# EAGLE design LightPlay1 (EAGLE 7.2.0)
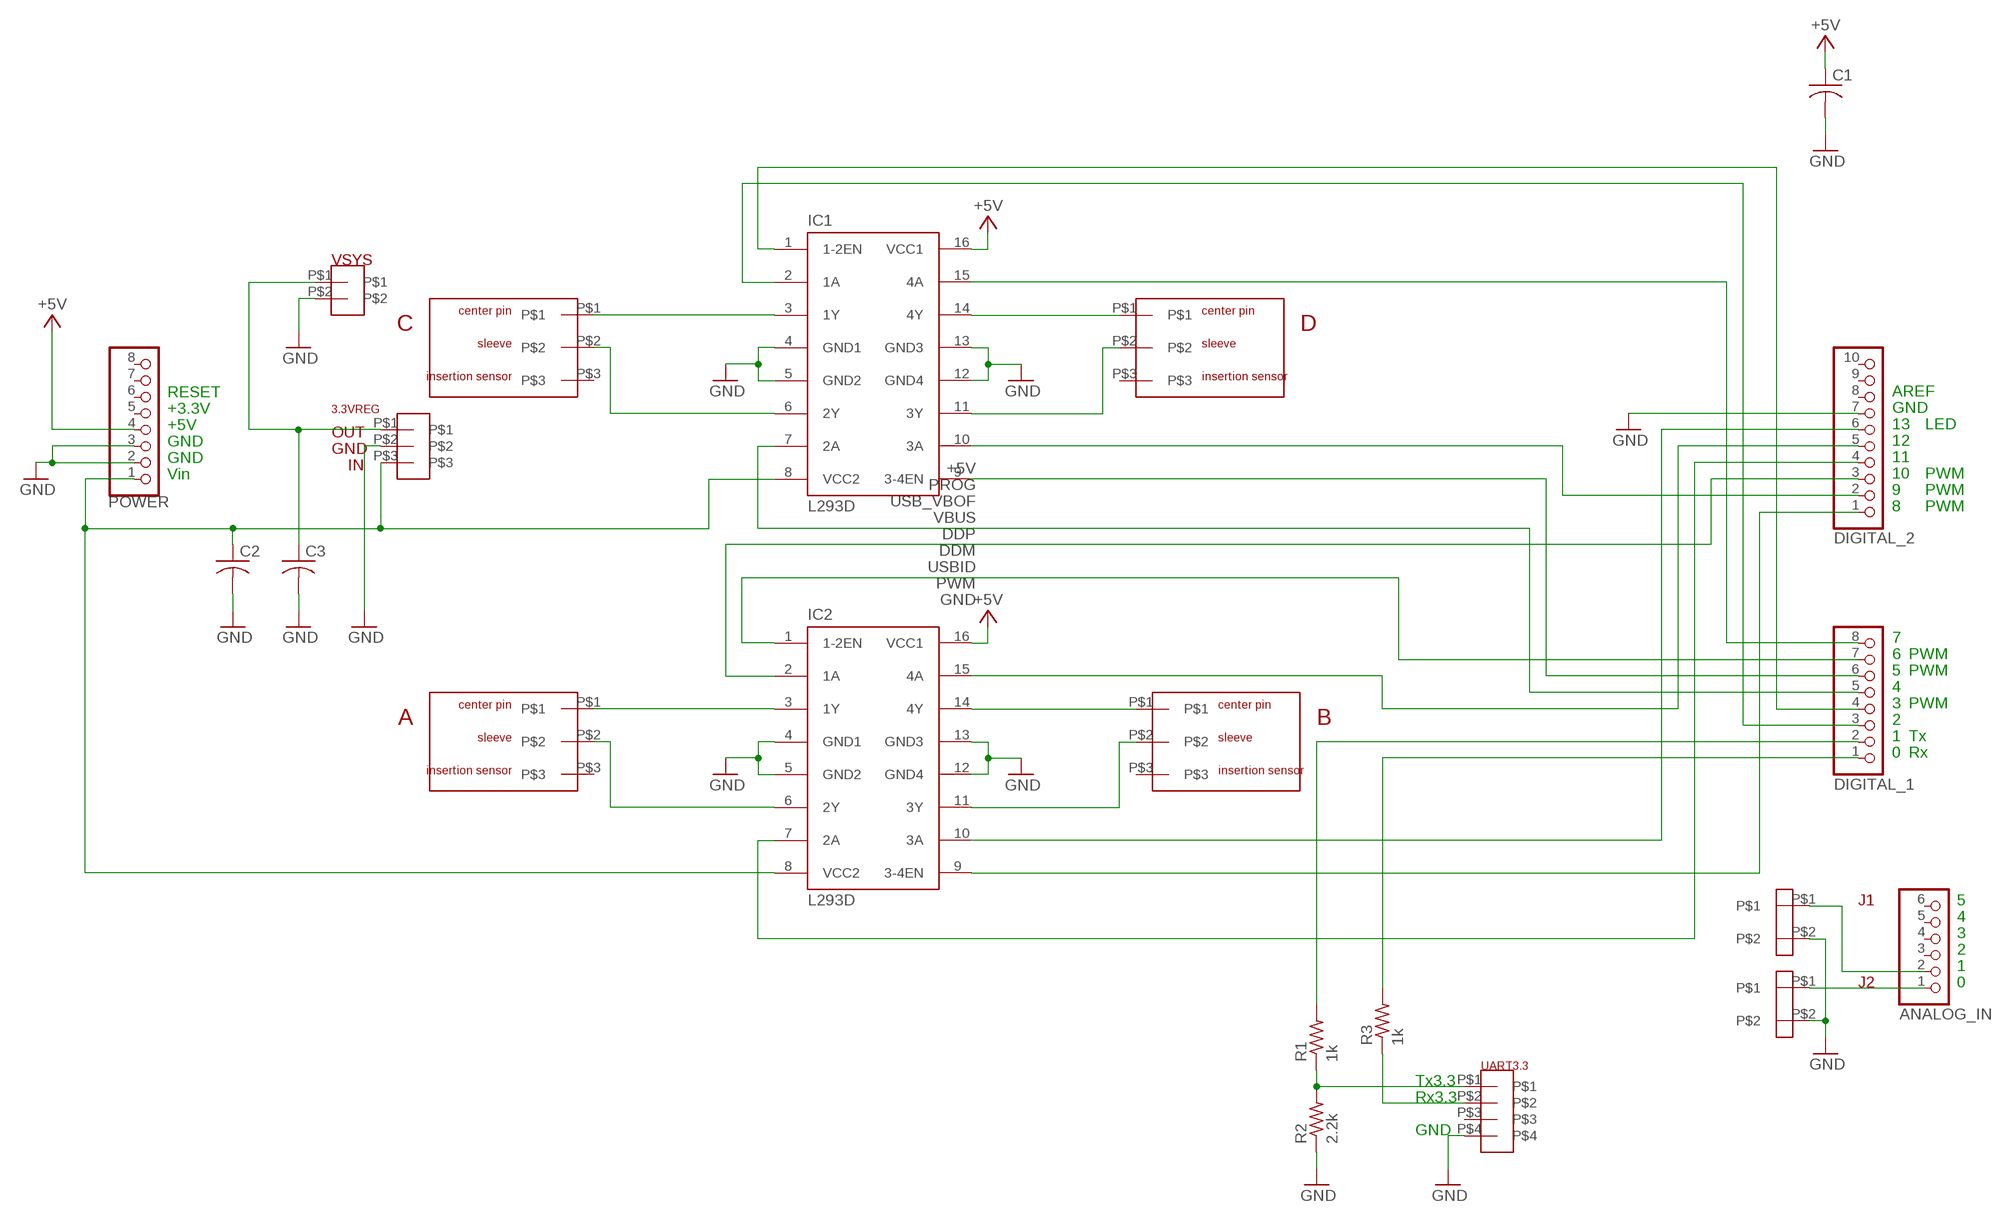
[diagram p0: schematic, sheet 1]

## Parts
3.3VREG  LP38691_33REG  [TO-252]
A  PJ-075DH-SMT-TR  [PJ-075DH-SMT-TR]
ANALOG_IN  PINHD-1X6TH  [1X06-TH]
B  PJ-075DH-SMT-TR  [PJ-075DH-SMT-TR]
C  PJ-075DH-SMT-TR  [PJ-075DH-SMT-TR]
C1  C-USC1206  [C1206]
C2  C-USC1206  [C1206]
C3  C-USC1206  [C1206]
D  PJ-075DH-SMT-TR  [PJ-075DH-SMT-TR]
DIGITAL_1  PINHD-1X8TH  [1X08-TH]
DIGITAL_2  PINHD-1X10TH  [1X10-TH]
IC1  L293D  [DIL16]
IC2  L293D  [DIL16]
J1  3.5MM_2PIN_SCREWTERMINAL_SPARKFUN  [1X02_3.5_SCREWTERM]
J2  3.5MM_2PIN_SCREWTERMINAL_SPARKFUN  [1X02_3.5_SCREWTERM]
POWER  PINHD-1X8TH  [1X08-TH]
R1  1k  R-US_M1206  [M1206]
R2  2.2k  R-US_M1206  [M1206]
R3  1k  R-US_M1206  [M1206]
UART3.3  4PADS_ROBBIE  [1X04_ROBBIE]
VSYS  1X2HEADER_ROBBIE  [1X2HEADER_ROBBIE]

## Nets
+5V: C1.1 IC1.16(VCC1) IC2.16(VCC1) POWER.4
GND: 3.3VREG.P$2 C1.2 C2.2 C3.2 DIGITAL_2.7 IC1.4(GND1) IC1.5(GND2) IC1.12(GND4) IC1.13(GND3) IC2.4(GND1) IC2.5(GND2) IC2.12(GND4) IC2.13(GND3) J1.P$2 J2.P$2 POWER.2 POWER.3 R2.1 UART3.3.P$4 VSYS.P$2
N$1: D.P$2 IC1.11(3Y)
N$2: ANALOG_IN.1 J2.P$1
N$3: D.P$1 IC1.14(4Y)
N$4: B.P$1 IC2.14(4Y)
N$5: ANALOG_IN.2 J1.P$1
N$6: 3.3VREG.P$3 C2.1 IC1.8(VCC2) IC2.8(VCC2) POWER.1
N$7: B.P$2 IC2.11(3Y)
N$8: C.P$1 IC1.3(1Y)
N$9: C.P$2 IC1.6(2Y)
N$10: A.P$1 IC2.3(1Y)
N$11: A.P$2 IC2.6(2Y)
N$12: DIGITAL_1.4 IC1.1(1-2EN)
N$13: DIGITAL_1.6 IC1.9(3-4EN)
N$14: DIGITAL_1.7 IC2.1(1-2EN)
N$15: DIGITAL_2.1 IC2.9(3-4EN)
N$16: DIGITAL_1.3 IC1.2(1A)
N$17: DIGITAL_1.5 IC1.7(2A)
N$18: DIGITAL_1.8 IC1.15(4A)
N$19: DIGITAL_2.2 IC1.10(3A)
N$20: DIGITAL_2.3 IC2.2(1A)
N$21: DIGITAL_2.4 IC2.7(2A)
N$22: DIGITAL_2.5 IC2.15(4A)
N$23: DIGITAL_2.6 IC2.10(3A)
N$25: 3.3VREG.P$1 C3.1 VSYS.P$1
N$26: R1.1 R2.2 UART3.3.P$1
N$27: DIGITAL_1.2 R1.2
N$28: DIGITAL_1.1 R3.2
N$29: R3.1 UART3.3.P$2
Unconnected: A.P$3 ANALOG_IN.3 ANALOG_IN.4 ANALOG_IN.5 ANALOG_IN.6 B.P$3 C.P$3 D.P$3 DIGITAL_2.8 DIGITAL_2.9 DIGITAL_2.10 POWER.5 POWER.6 POWER.7 POWER.8 UART3.3.P$3

## Notes on the sheet
- RESET | AREF
- +3.3V | GND
- +5V | 13 | LED
- GND | 12
- GND | +5V | 11
- Vin | PROG | 10 | PWM
- USB_VBOF | 9 | PWM
- VBUS | 8 | PWM
- DDP
- DDM
- USBID
- PWM
- GND
- 7
- 6 | PWM
- 5 | PWM
- 4
- 3 | PWM
- 2
- 1 | Tx
- 0 | Rx
- 5
- 4
- 3
- 2
- 1
- 0
- Tx3.3
- Rx3.3
- GND

## Library data of the parts
3.3VREG = robbie:LP38691_33REG
A B C D = robbie:PJ-075DH-SMT-TR
ANALOG_IN = SmartPrj:PINHD-1X6: PIN HEADER
C1-C3 = resistor:C-US: CAPACITOR, American symbol
DIGITAL_1 POWER = SmartPrj:PINHD-1X8: PIN HEADER
DIGITAL_2 = SmartPrj:PINHD-1X10: PIN HEADER
IC1 IC2 = st-microelectronics:L293D: PUSH-PULL 4 CHANNEL DRIVER; MPN: L293D; OC_FARNELL: 9589619; OC_NEWARK: 56P8249
J1 J2 = robbie:3.5MM_2PIN_SCREWTERMINAL_SPARKFUN
R1-R3 = robbie:R-US_: RESISTOR, American symbol
UART3.3 = robbie:4PADS_ROBBIE
VSYS = robbie:1X2HEADER_ROBBIE

## Net classes
0 default: width 0.203 mm, drill 0.305 mm, clearance 0.178 mm
1 power: width 0.254 mm, drill 0.61 mm, clearance 0.203 mm
2 VIN: width 0.61 mm, drill 0.813 mm, clearance 0.305 mm
3 usbvcc: width 0.508 mm, drill 0.508 mm, clearance 0.152 mm
4 aref: width 0.406 mm

## Board
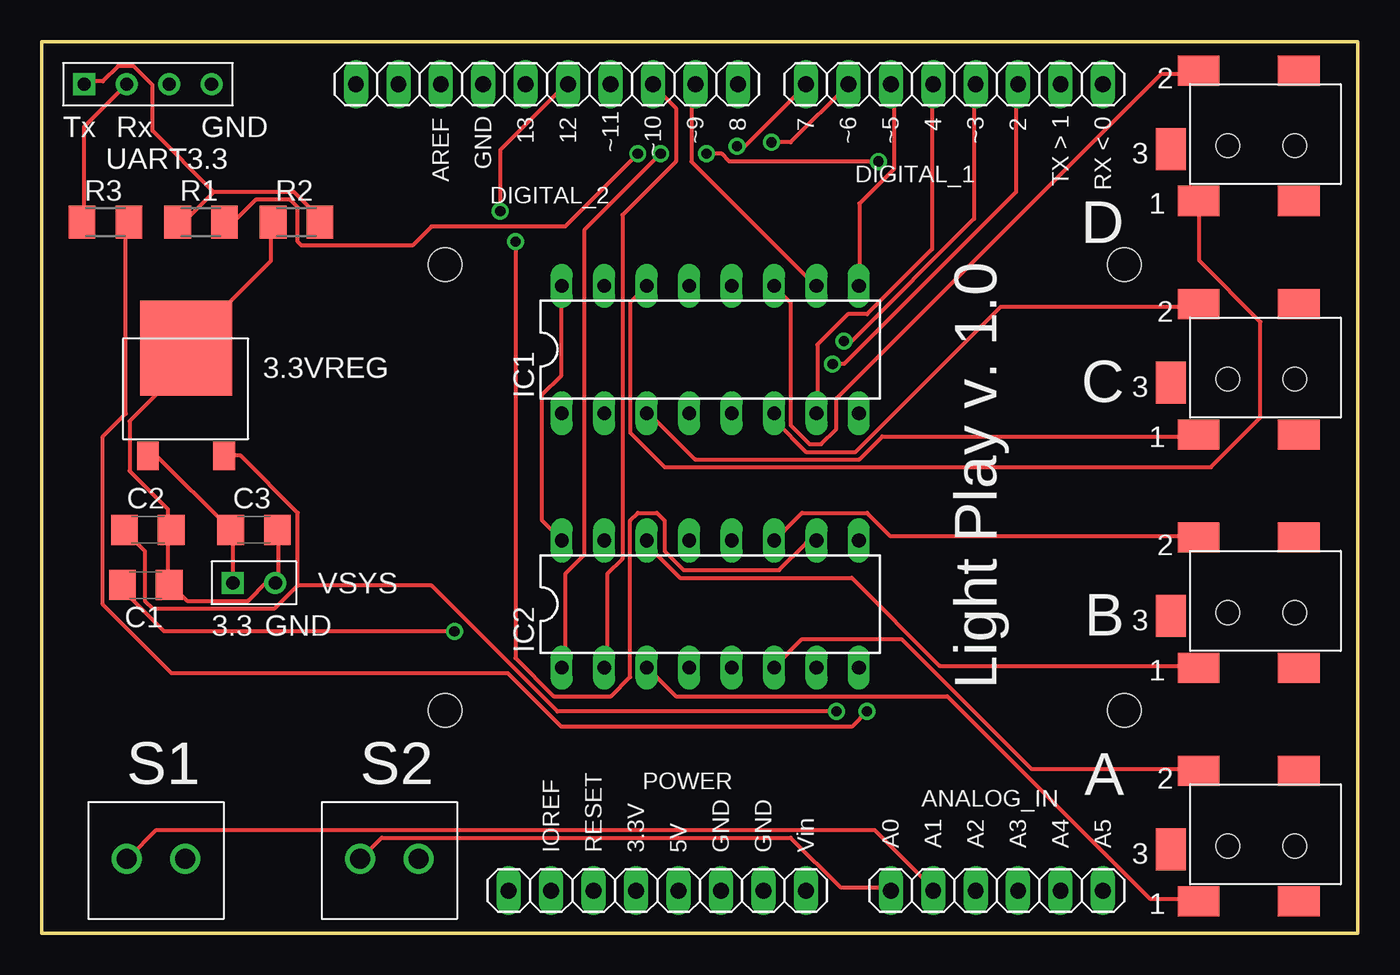
[diagram p1: board, top side]
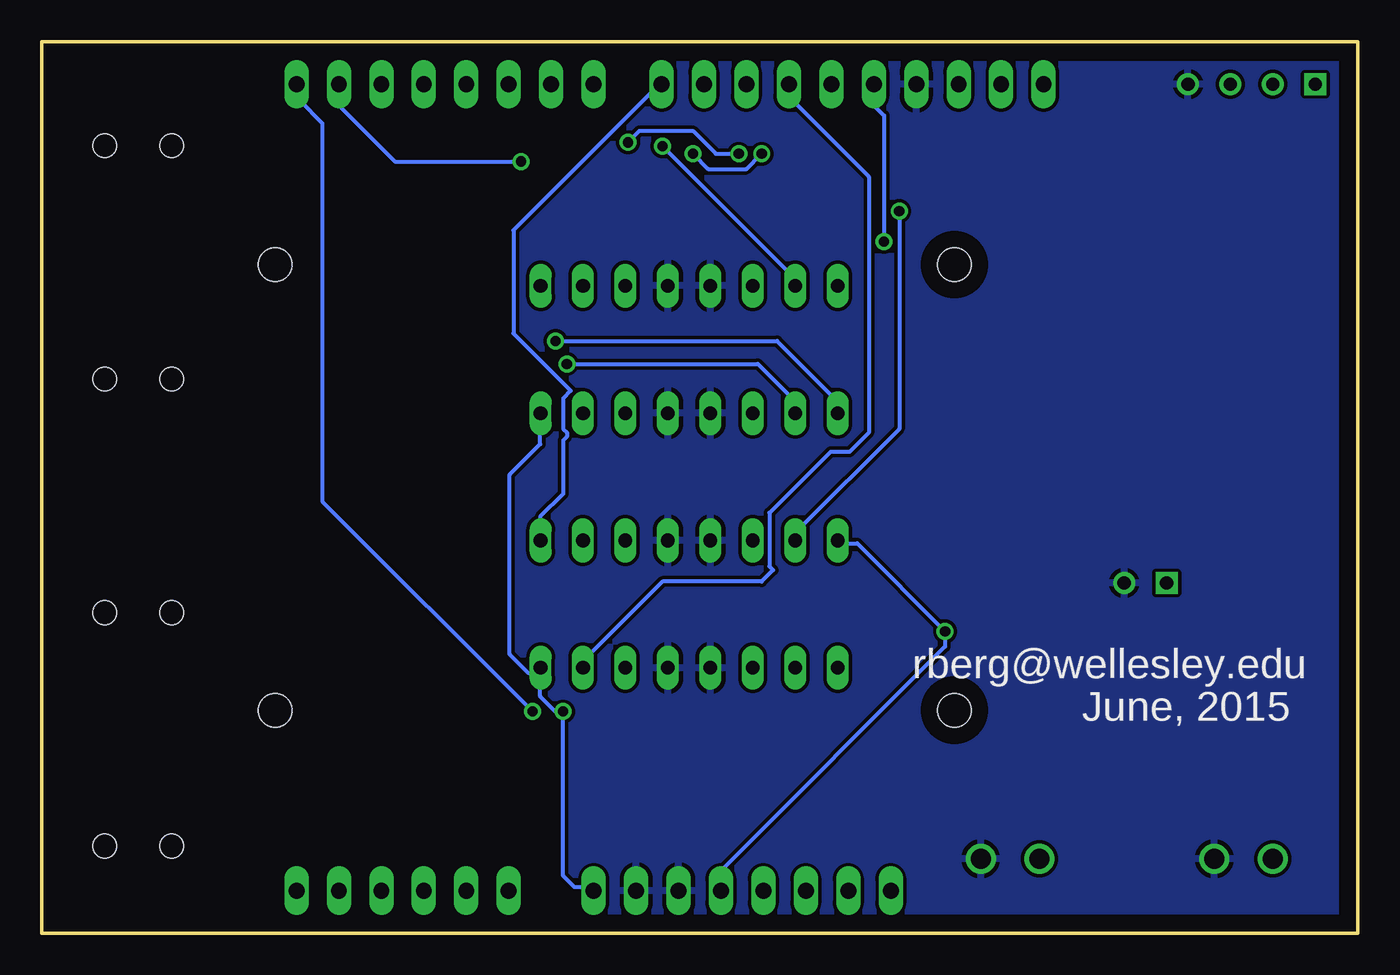
[diagram p2: board, bottom side, seen from below]

Size 78.74 x 53.34 mm. Coordinates in mm from the lower left corner, seen from the top.
Outline: 78.74,53.34 0,53.34 0,0 78.74,0 78.74,53.34
Copper layers (1*16): Top 0.035mm / dielectric 1.5mm / Bottom 0.035mm
Design rules "default": minimum track width 10mil, minimum drill 24mil, track to track 8mil, track to pad 8mil, pad to pad 8mil, via to via 8mil, smd to smd 8mil, copper to edge 40mil, drill to drill 8mil, minimum pad ring 10mil, minimum via ring 8mil, stop-mask expansion 4mil, vias tented up to drill 0mil, thermal gap 10mil
Holes 2 mm at 64.77,40.01 24.13,40.01 24.13,13.34 64.77,13.34

### Footprints (pad centres in the part's own frame; a part is rotated, then mirrored left to right if it is on the bottom)
TO-252 = smd 1.3 x 1.7: P$1 0,0; P$3 4.57,0 | smd 5.5 x 5.7: P$2 2.285,6.44
PJ-075DH-SMT-TR = smd 2.5 x 1.8: P$1 0,0; P$2 0,-7.8; P$4 -6,0; P$5 -6,-7.8 | smd 1.8 x 2.5: P$3 1.65,-3.1 | hole 1.4: -5.75,-3.3; -1.75,-3.3
1X06-TH = drill 0.95 pad 1.422 long: 1 -6.35,0; 2 -3.81,0; 3 -1.27,0; 4 1.27,0; 5 3.81,0; 6 6.35,0
C1206 = smd 1.6 x 1.8: 1 -1.4,0; 2 1.4,0
1X08-TH = drill 0.95 pad 1.422 long: 1 -8.89,0; 2 -6.35,0; 3 -3.81,0; 4 -1.27,0; 5 1.27,0; 6 3.81,0; 7 6.35,0; 8 8.89,0
1X10-TH = drill 0.95 pad 1.422 long: 1 -11.43,0; 2 -8.89,0; 3 -6.35,0; 4 -3.81,0; 5 -1.27,0; 6 1.27,0; 7 3.81,0; 8 6.35,0; 9 8.89,0; 10 11.43,0
DIL16 = drill 0.813 long: 1 -8.89,-3.81; 2 -6.35,-3.81; 3 -3.81,-3.81; 4 -1.27,-3.81; 5 1.27,-3.81; 6 3.81,-3.81; 7 6.35,-3.81; 8 8.89,-3.81; 9 8.89,3.81; 10 6.35,3.81; 11 3.81,3.81; 12 1.27,3.81; 13 -1.27,3.81; 14 -3.81,3.81; 15 -6.35,3.81; 16 -8.89,3.81
1X02_3.5_SCREWTERM = drill 1.2: P$1 0,0; P$2 3.5,0
M1206 = smd 1.6 x 2: 1 -1.4,0; 2 1.4,0
1X04_ROBBIE = drill 0.8 square: P$1 0,0 | drill 0.8: P$2 2.54,0; P$3 5.08,0; P$4 7.62,0
1X2HEADER_ROBBIE = drill 0.8 square: P$1 0,0 | drill 0.8: P$2 2.54,0

### Placement (x,y rotation side)
3.3VREG  6.35,28.57 0 top
A  69.22,1.91 180 top
ANALOG_IN  57.15,2.54 0 top
B  69.22,15.88 180 top
C  69.22,29.84 180 top
C1  6.22,20.83 0 top
C2  6.35,24.13 0 top
C3  12.7,24.13 0 top
D  69.22,43.81 180 top
DIGITAL_1  54.61,50.8 180 top
DIGITAL_2  30.23,50.8 180 top
IC1  40.01,34.92 0 top
IC2  40.01,19.68 0 top
J1  5.08,4.45 0 top
J2  19.05,4.45 0 top
POWER  36.83,2.54 180 top
R1  9.53,42.55 0 top
R2  15.24,42.55 0 top
R3  3.81,42.55 0 top
UART3.3  2.54,50.8 0 top
VSYS  11.43,20.95 0 top

### Tracks (layer width: path | path; a pad name or v marks a point on that pad's centre or on a via)
+5V  (via drill 0.61)
  Top 0.254: v24.69,18.06 7.32,18.06 5.03,20.34 5.03,20.8 C1.1 | IC1.16 31.09,38.63 31.09,33.38 29.95,32.23 29.95,24.69 31.09,23.55 IC2.16
  Bottom 0.254: IC2.16 31.09,23.32 29.95,23.32 v24.69,18.06 24.69,17.14 37.95,3.89 37.95,2.74 POWER.4
GND
  Top 0.254: C3.2 14.17,24 14.17,21.03 VSYS.P$2 13.95,21.03 13.49,21.03 12.34,19.89 8.69,19.89 7.77,20.8 C1.2 7.54,21.03 7.54,24 C2.2 7.54,24.23 7.54,25.38 5.26,27.66 5.26,30.63 8.46,33.83 8.46,34.98 3.3VREG.P$2 8.69,35.2 13.72,40.23 13.72,42.52 R2.1
  pour Bottom: 1.27,52.07 76.2,52.07 76.2,1.27 1.27,1.27
N$1
  Top 0.254: D.P$2 69.04,51.44 66.98,51.44 47.55,32 47.55,30.18 46.63,29.26 45.95,29.26 44.81,30.4 44.81,37.72 43.89,38.63 IC1.11
N$2
  Top 0.254: ANALOG_IN.1 50.75,2.74 47.78,2.74 44.81,5.71 20.34,5.71 19.2,4.57 J2.P$1
N$3
  Top 0.254: D.P$1 69.27,43.66 69.27,40.23 72.92,36.58 72.92,30.86 69.95,27.89 37.26,27.89 35.2,29.95 35.2,37.72 36.12,38.63 IC1.14
N$4
  Top 0.254: B.P$1 69.04,16 53.72,16 48.46,21.26 38.18,21.26 36.12,23.32 IC2.14
N$5
  Top 0.254: ANALOG_IN.2 53.26,2.74 49.84,6.17 6.86,6.17 5.26,4.57 J1.P$1
N$6  (via drill 0.61)
  Top 0.254: 3.3VREG.P$3 11.89,28.57 15.32,25.15 15.32,20.8 | 15.32,20.8 13.95,19.43 6.63,19.43 6.17,19.89 6.17,22.86 5.03,24 C2.1 | 15.32,20.8 23.32,20.8 30.86,13.26 v47.55,13.26
  Bottom 0.254: 48.92,15.54 48.92,14.17 47.78,13.03 | 48.92,15.54 48.92,15.77 IC2.8 48.92,15.54 | 47.78,13.03 47.55,12.8 47.55,3.43 46.86,2.74 45.72,2.74 POWER.1 | 48.92,15.54 49.61,15.54 50.75,16.69 50.75,27.43 48.92,29.26 48.92,31.09 IC1.8 | 47.78,13.03 v47.55,13.26
N$7
  Top 0.254: B.P$2 69.04,23.77 50.75,23.77 49.38,25.15 45.49,25.15 43.89,23.55 IC2.11
N$8
  Top 0.254: C.P$1 69.04,29.72 50.29,29.72 48.92,28.35 39.09,28.35 36.35,31.09 IC1.3
N$9
  Top 0.254: C.P$2 69.04,37.49 57.38,37.49 48.69,28.8 45.72,28.8 43.89,30.63 43.89,31.09 IC1.6
N$10
  Top 0.254: A.P$1 69.04,2.06 66.29,2.06 54.18,14.17 37.95,14.17 36.35,15.77 IC2.3
N$11
  Top 0.254: A.P$2 69.04,9.83 59.21,9.83 51.44,17.6 45.49,17.6 43.89,16 IC2.6
N$12  (via drill 0.61)
  Top 0.254: v48.01,35.43 48.46,35.43 55.78,42.75 55.78,50.75 DIGITAL_1.4
  Bottom 0.254: v48.01,35.43 34.75,35.43 31.32,32 31.32,31.32 IC1.1
N$13
  Top 0.254: IC1.9 48.92,38.86 48.92,43.66 50.98,45.72 50.98,50.75 DIGITAL_1.6
N$14  (via drill 0.61)
  Top 0.254: v37.03,46.63 32.46,42.06 32.46,22.63 31.32,21.49 31.32,16 IC2.1 | v43.66,47.32 44.81,47.32 48.23,50.75 DIGITAL_1.7
  Bottom 0.254: v37.03,46.63 38.41,46.63 39.78,48.01 42.98,48.01 v43.66,47.32
N$15
  Bottom 0.254: IC2.9 48.92,23.55 48.92,24.92 47.55,26.29 47.55,29.49 47.32,29.72 47.32,29.95 47.55,30.18 47.55,32 47.09,32.46 50.52,35.89 50.52,42.06 41.83,50.75 DIGITAL_2.1
N$16  (via drill 0.61)
  Top 0.254: v47.32,34.06 48.01,34.06 58.29,44.35 58.29,50.75 DIGITAL_1.3
  Bottom 0.254: v47.32,34.06 35.89,34.06 33.83,32 33.83,31.32 IC1.2
N$17
  Top 0.254: IC1.7 46.41,31.32 46.41,35.2 48.23,37.03 49.38,37.03 53.26,40.92 53.26,50.75 DIGITAL_1.5
N$18  (via drill 0.61)
  Top 0.254: v41.6,47.09 42.06,47.09 45.72,50.75 DIGITAL_1.8
  Bottom 0.254: v41.6,47.09 33.83,39.32 33.83,38.86 IC1.15
N$19
  Top 0.254: IC1.10 46.18,38.86 38.86,46.18 38.86,50.52 39.09,50.75 DIGITAL_2.2
N$20
  Top 0.254: IC2.2 33.83,16 33.83,21.49 34.75,22.4 34.75,42.98 37.95,46.18 37.95,49.38 36.58,50.75 DIGITAL_2.3
N$21
  Bottom 0.254: IC2.7 46.18,16 46.18,16.46 41.6,21.03 35.66,21.03 34.98,21.72 35.2,21.95 35.2,25.15 31.55,28.8 30.4,28.8 29.26,29.95 29.26,45.26 33.83,49.84 33.83,50.75 DIGITAL_2.4
N$22  (via drill 0.61)
  Top 0.254: v27.43,43.2 27.43,46.86 31.32,50.75 DIGITAL_2.5
  Bottom 0.254: v27.43,43.2 27.43,30.18 33.6,24 33.6,23.55 IC2.15
N$23  (via drill 0.61)
  Top 0.254: v28.35,41.38 28.35,16.46 30.63,14.17 34.06,14.17 35.2,15.32 35.2,24.69 35.66,25.15 36.8,25.15 37.26,24.69 37.26,22.86 38.41,21.72 44.12,21.72 45.72,23.32 46.18,23.32 IC2.10
  Bottom 0.254: v28.35,41.38 28.35,48.92 28.8,49.38 28.8,50.75 DIGITAL_2.6
N$25
  Top 0.254: 3.3VREG.P$1 6.86,28.57 11.2,24.23 C3.1 11.43,24 VSYS.P$1
N$26
  Top 0.254: 10.29,44.35 8.69,42.75 8.23,42.75 R1.1 | 10.29,44.35 15.09,44.35 16.69,42.75 R2.2 | 10.29,44.35 6.63,48.01 6.63,50.75 5.49,51.89 4.57,51.89 3.66,50.98 2.74,50.98 UART3.3.P$1
N$27  (via drill 0.61)
  Top 0.254: v35.66,46.63 31.32,42.29 23.32,42.29 22.17,41.15 15.54,41.15 15.32,41.38 15.32,43.43 14.86,43.89 12.8,43.89 11.66,42.75 10.97,42.75 R1.2 | v39.78,46.63 40.69,46.63 41.15,46.18 v50.06,46.18
  Bottom 0.254: v35.66,46.63 36.58,45.72 38.86,45.72 v39.78,46.63 | v50.06,46.18 57.61,46.18 60.81,49.38 60.81,50.75 DIGITAL_1.2
N$28  (via drill 0.61)
  Top 0.254: v49.38,13.26 48.46,12.34 31.09,12.34 27.89,15.54 7.77,15.54 3.66,19.66 3.66,29.72 5.03,31.09 5.03,42.52 R3.2
  Bottom 0.254: v49.38,13.26 61.95,25.83 61.95,48.46 63.32,49.84 63.32,50.75 DIGITAL_1.1
N$29
  Top 0.254: UART3.3.P$2 2.52,48.23 2.52,42.75 R3.1

### Text on the board
tPlace: Tx | Rx | GND | 8 | 7 | 4 | 2 | 13 | 12 | ~11 | ~9 | ~6 | ~5 | ~3 | GND | ~10 | AREF | TX > 1 | RX < 0 | 3.3 | GND | Light Play v. 1.0 | S1 | S2 | IOREF | RESET | 3.3V | 5V | GND | GND | Vin | A0 | A1 | A2 | A3 | A4 | A5
bPlace: rberg@wellesley.edu | June, 2015